# EAGLE design asm (EAGLE 9.6.2)
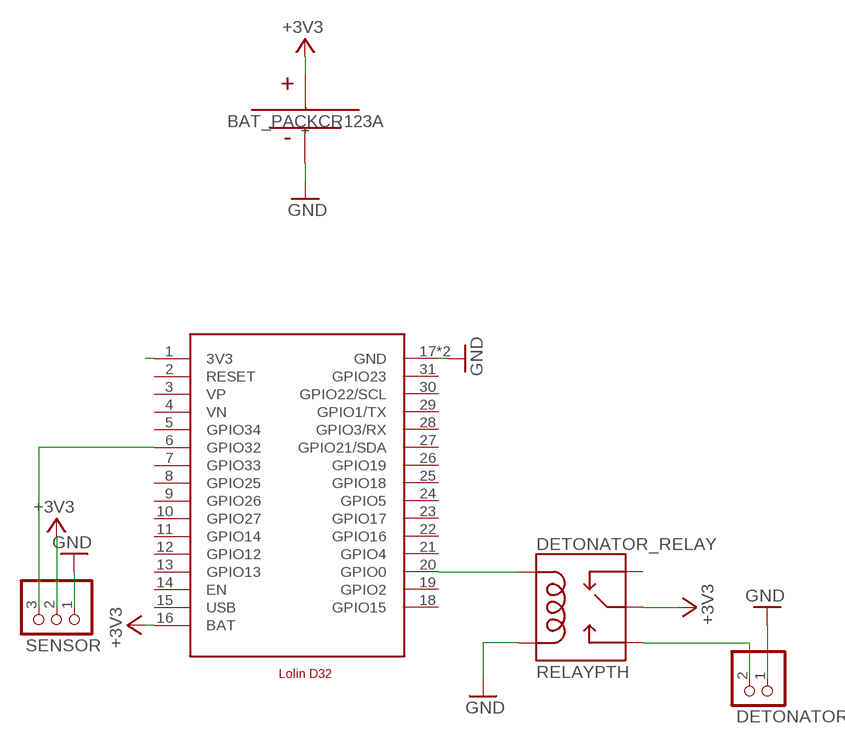
[diagram p0: schematic, sheet 1]

## Parts
CR123A  BAT_PACKCR123A  [BH123A]
DETONATOR  PINHD-1X2  [1X02]
DETONATOR_RELAY  RELAYPTH  [SRD-05VDC-SL-C]
ESP32  LOLIND32  [LOLIND32]
SENSOR  PINHD-1X3  [1X03]

## Nets
+3V3: CR123A.+ DETONATOR_RELAY.SWCOMMON ESP32.16(BAT) SENSOR.2
GND: CR123A.- DETONATOR.1 DETONATOR_RELAY.COIL0 ESP32.17(GND) ESP32.32(GND) SENSOR.1
N$1: ESP32.6(GPIO32) SENSOR.3
N$2: DETONATOR_RELAY.COIL1 ESP32.20(GPIO0)
N$3: DETONATOR.2 DETONATOR_RELAY.SWOPEN
N$4: ESP32.1(3V3)
Unconnected: DETONATOR_RELAY.SWCLOSED(SWCLOSE) ESP32.2(RESET) ESP32.3(VP) ESP32.4(VN) ESP32.5(GPIO34) ESP32.7(GPIO33) ESP32.8(GPIO25) ESP32.9(GPIO26) ESP32.10(GPIO27) ESP32.11(GPIO14) ESP32.12(GPIO12) ESP32.13(GPIO13) ESP32.14(EN) ESP32.18(GPIO15) ESP32.19(GPIO2) ESP32.21(GPIO4) ESP32.22(GPIO16) ESP32.23(GPIO17) ESP32.24(GPIO5) ESP32.25(GPIO18) ESP32.26(GPIO19) ESP32.27(GPIO21/SDA) ESP32.28(GPIO3/RX) ESP32.29(GPIO1/TX) ESP32.30(GPIO22/SCL) ESP32.31(GPIO23)

## Power pins joined to a net without a drawn wire
USB: ESP32.15(USB)

## Library data of the parts
CR123A = batteries:BAT_PACK: collection of battery footprints; DIGIKEY: BH123A-ND; MANUFACTURER: MPD; MPN: BH123A
DETONATOR = pinhead:PINHD-1X2: PIN HEADER
DETONATOR_RELAY = SRD-05VDC-SL-C:RELAY: SPDT relay (COM-00101)
ESP32 = esp32:LOLIND32: Wemos Lolin D32 Lolin D32 is a development board based on ESP32. On this schematic, this board is designed with battery port. Pins VP and VN are Not Connected pins.
SENSOR = pinhead:PINHD-1X3: PIN HEADER

## Board
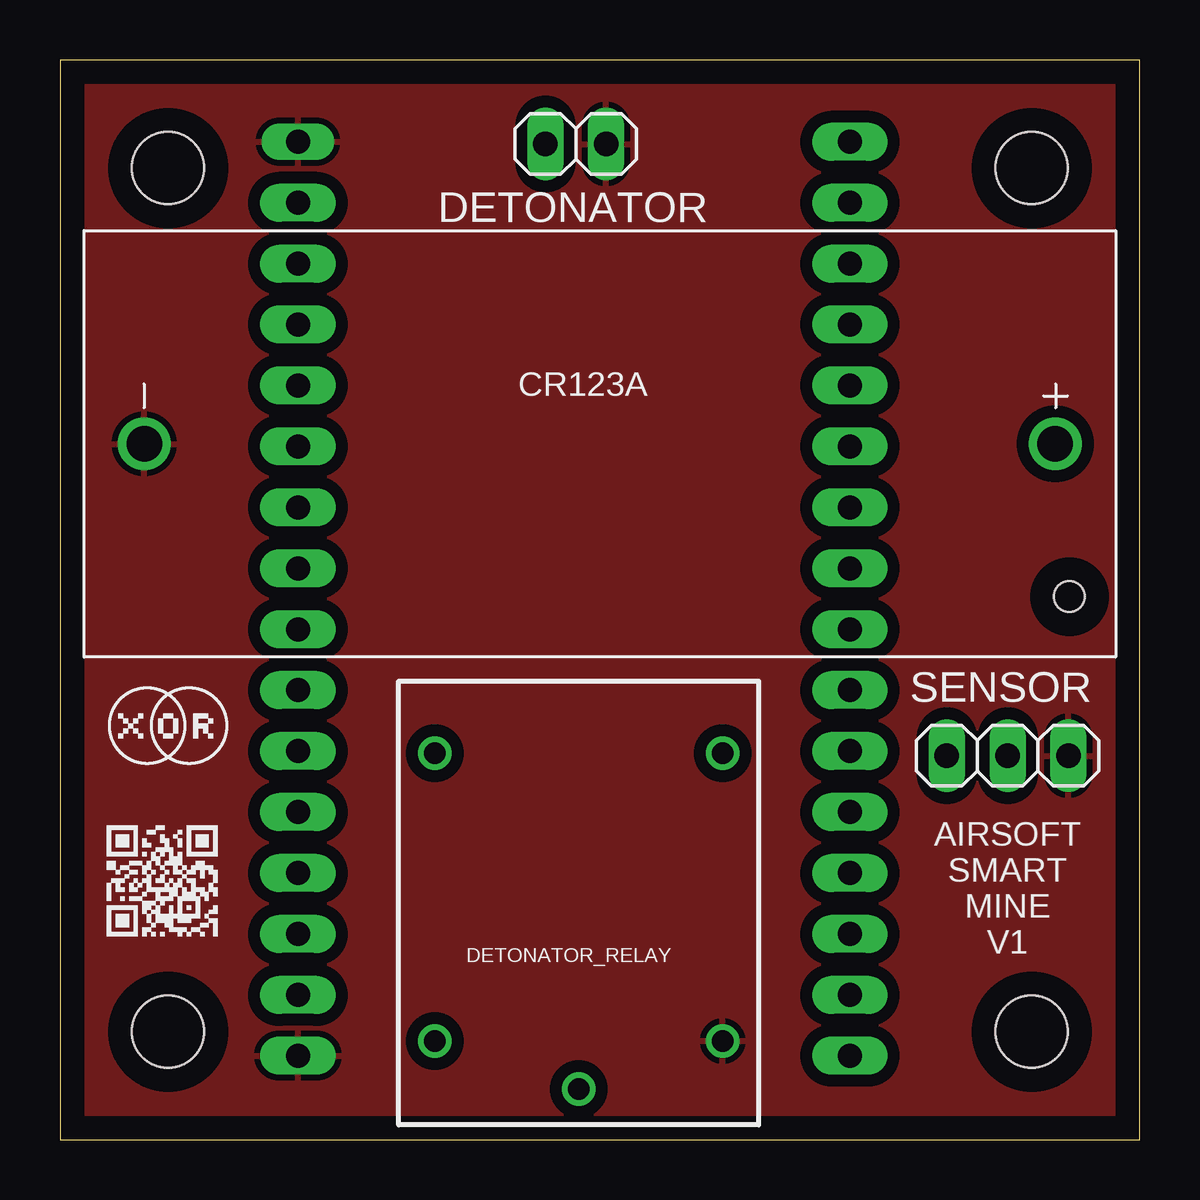
[diagram p1: board, top side]
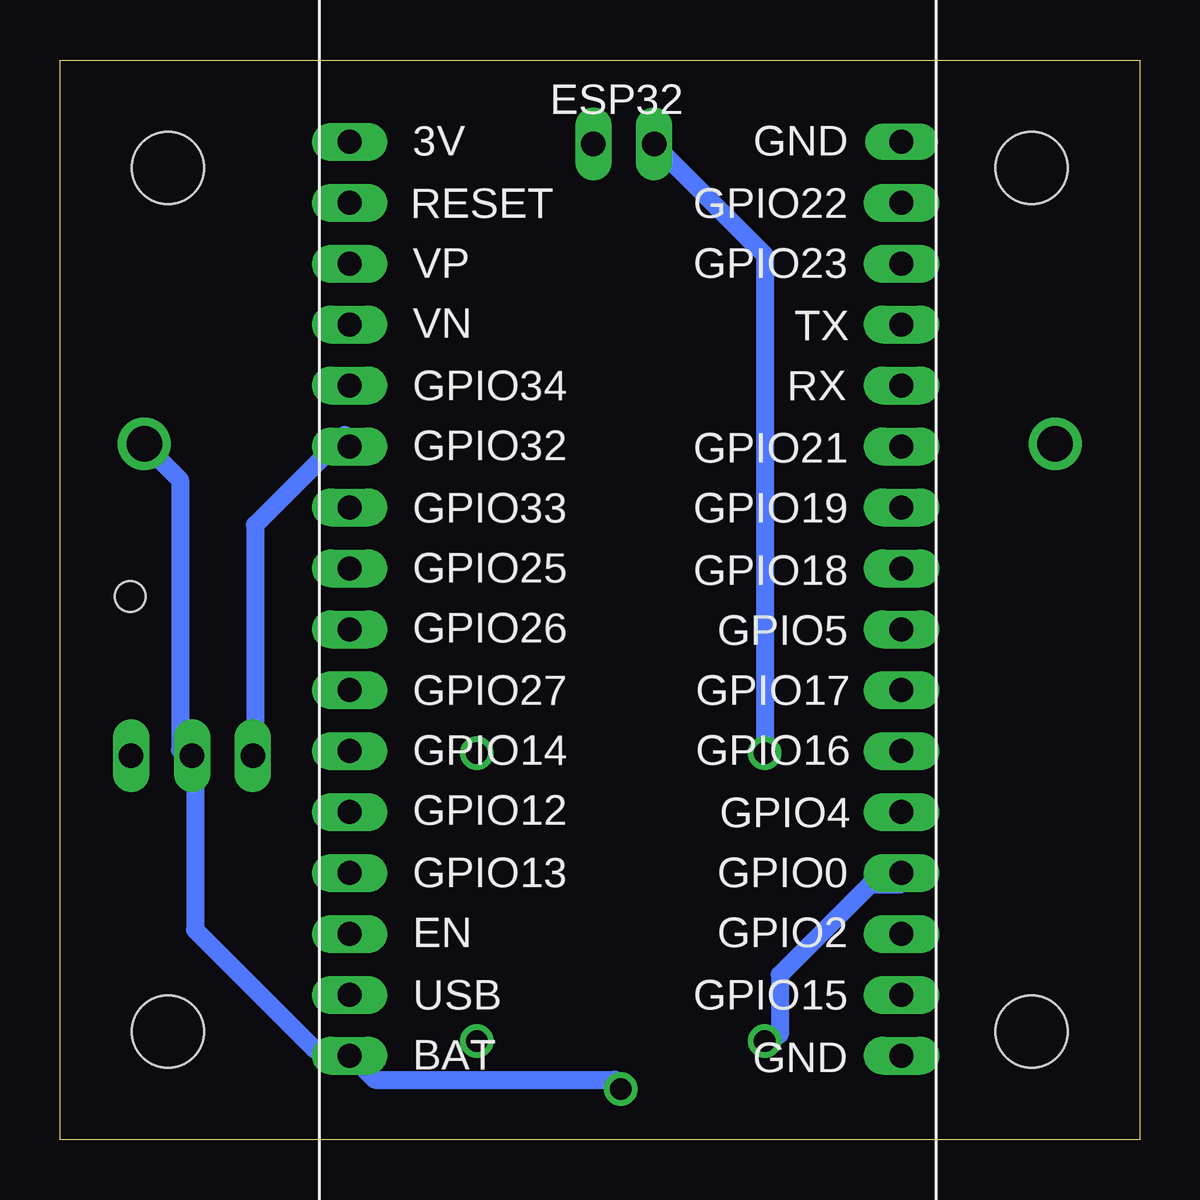
[diagram p2: board, bottom side, seen from below]

Size 45 x 45 mm. Coordinates in mm from the lower left corner, seen from the top.
Outline: 0,0 45,0 45,45 0,45 0,0
Copper layers (1*16): Top 0.035mm / dielectric 1.5mm / Bottom 0.035mm
Design rules "default *": minimum track width 0.75mm, minimum drill 0.35mm, track to track 0.5mm, track to pad 0.5mm, pad to pad 0.5mm, via to via 0.5mm, smd to smd 0.5mm, copper to edge 1mm, drill to drill 0.15mm, minimum pad ring 0.25mm, minimum via ring 0.2mm, stop-mask expansion 0.1mm, vias tented up to drill 0mil, thermal gap 0.25mm
Holes 3 mm at 40.5,4.5 40.5,40.5 4.5,40.5 4.5,4.5

### Footprints (pad centres in the part's own frame; a part is rotated, then mirrored left to right if it is on the bottom)
BH123A = drill 1.47: + 18.985,0; - -18.985,0 | hole 1.27: 19.58,-6.37
1X02 = drill 1.016 long: 1 -1.27,0; 2 1.27,0
SRD-05VDC-SL-C = drill 0.9: COIL0 -5.39,-6.12; COIL1 -5.39,5.88; SWCLOSED 6.61,-6.12; SWCOMMON -7.39,-0.12; SWOPEN 6.61,5.88
LOLIND32 = drill 1 pad 1.575 long: 1 -11.43,21.59; 2 -11.43,19.05; 3 -11.43,16.51; 4 -11.43,13.97; 5 -11.43,11.43; 6 -11.43,8.89; 7 -11.43,6.35; 8 -11.43,3.81; 9 -11.43,1.27; 10 -11.43,-1.27; 11 -11.43,-3.81; 12 -11.43,-6.35; 13 -11.43,-8.89; 14 -11.43,-11.43; 15 -11.43,-13.97; 16 -11.43,-16.51; 17 11.58,-16.51; 18 11.58,-13.97; 19 11.58,-11.43; 20 11.58,-8.89; 21 11.58,-6.35; 22 11.58,-3.81; 23 11.58,-1.27; 24 11.58,1.27; 25 11.58,3.81; 26 11.58,6.35; 27 11.58,8.89; 28 11.58,11.43; 29 11.58,13.97; 30 11.58,16.51; 31 11.58,19.05 | drill 1 pad 1.524 long: 32 11.58,21.59
1X03 = drill 1.016 long: 1 -2.54,0; 2 0,0; 3 2.54,0

### Placement (x,y rotation side)
CR123A  22.5,29 0 top
DETONATOR  21.5,41.5 180 top
DETONATOR_RELAY  21.5,9.5 90 top
ESP32  21.5,20 0 bottom
SENSOR  39.5,16 180 top

### Tracks (layer width: path | path; a pad name or v marks a point on that pad's centre or on a via)
+3V3
  Bottom 0.75: DETONATOR_RELAY.SWCOMMON 21.88,2.5 31.88,2.5 32.5,3.12 ESP32.16 33.12,3.75 34.38,3.75 39.38,8.75 39.38,15.62 SENSOR.2 40,16.25 40,27.5 41.25,28.75 CR123A.+
GND
  pour Top: -0.5,45.5 -0.5,-0.5 45.5,-0.5 45.5,45.5
N$1
  Bottom 0.75: SENSOR.3 36.88,16.25 36.88,25.62 33.12,29.38 ESP32.6
N$2
  Bottom 0.75: DETONATOR_RELAY.COIL1 15,4.38 15,6.88 11.25,10.62 10,10.62 ESP32.20
N$3
  Bottom 0.75: DETONATOR_RELAY.SWOPEN 15.62,16.25 15.62,36.88 20,41.25 DETONATOR.2

### Text on the board
tNames: AIRSOFT / SMART / MINE / V1 | C:/Users/saski/Downloads/url.bmp